# EAGLE schematic schema (EAGLE 7.5.0)
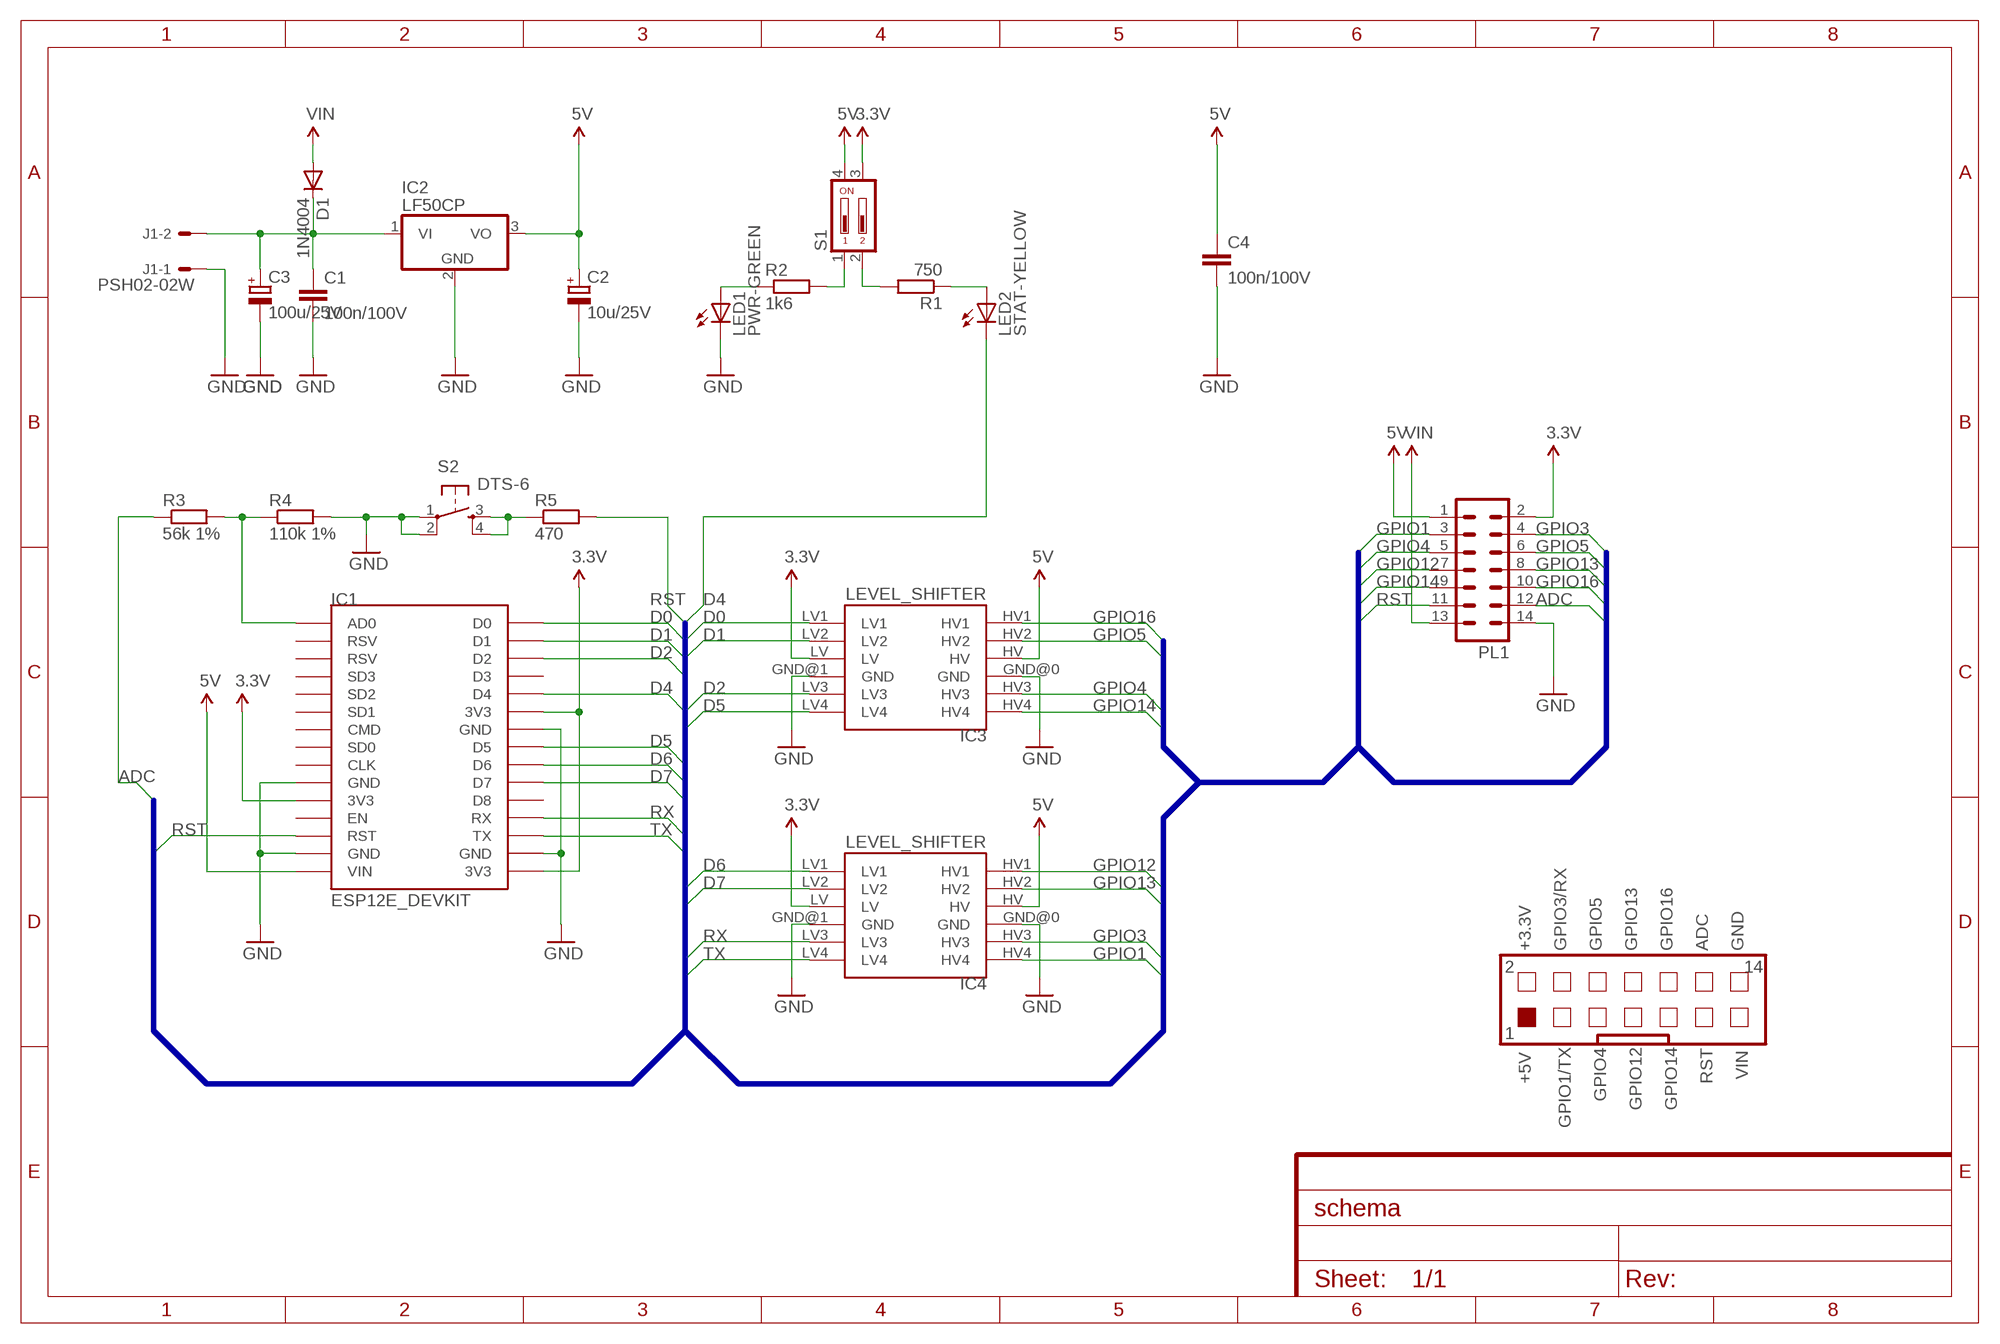
[diagram p0: schematic, sheet 1]
FRAME1 (FRAME-A4L): CNAME: IoT Lab Module; CREVISION: 1; DESIGNER: Vagovszky M.

## Parts
C1  100n/100V  C-EUC025-025X050  [C025-025X050]
C2  10u/25V  CPOL-EUE3,5-8  [E3,5-8]
C3  100u/25V  CPOL-EUE5-13  [E5-13]
C4  100n/100V  C-EUC025-025X050  [C025-025X050]
D1  1N4004  [DO41-10]
IC1  ESP12E_DEVKIT  [ESP12E_DEVKIT]
IC2  LF50CP  [TO220H]
IC3  LEVEL_SHIFTER  [LEVEL_SHIFTER]
IC4  LEVEL_SHIFTER  [LEVEL_SHIFTER]
J1  PSH02-02W  22-05-7028-02  [7395-02]
LED1  PWR-GREEN  LED3MM  [LED3MM]
LED2  STAT-YELLOW  LED3MM  [LED3MM]
PL1  14V  [14V]
R1  750  R-EU_R1206  [R1206]
R2  1k6  R-EU_R1206  [R1206]
R3  56k 1%  R-EU_R1206  [R1206]
R4  110k 1%  R-EU_R1206  [R1206]
R5  470  R-EU_R1206  [R1206]
S1  DIP02YL  [DIP02YL]
S2  DTS-6  [DTS-6]

## Nets
3.3V: IC1.3V3@0(3V3) IC1.3V3@1(3V3) IC1.3V3@2(3V3) IC3.LV IC4.LV PL1.2 S1.3
5V: C2.+ C4.1 IC1.VIN IC2.3(VO) IC3.HV IC4.HV PL1.1 S1.4
ADC: PL1.12 R3.1
D0: IC1.D0 IC3.LV1
D1: IC1.D1 IC3.LV2
D2: IC1.D2 IC3.LV3
D4: IC1.D4 LED2.K(C)
D5: IC1.D5 IC3.LV4
D6: IC1.D6 IC4.LV1
D7: IC1.D7 IC4.LV2
GND: C1.2 C2.- C3.- C4.2 IC1.GND@0(GND) IC1.GND@1(GND) IC1.GND@2(GND) IC1.GND@3(GND) IC2.2(GND) IC3.GND@0(GND) IC3.GND@1(GND) IC4.GND@0(GND) IC4.GND@1(GND) J1.1 LED1.K(C) PL1.14 R4.2 S2.1 S2.2
GPIO1: IC4.HV4 PL1.3
GPIO3: IC4.HV3 PL1.4
GPIO4: IC3.HV3 PL1.5
GPIO5: IC3.HV2 PL1.6
GPIO12: IC4.HV1 PL1.7
GPIO13: IC4.HV2 PL1.8
GPIO14: IC3.HV4 PL1.9
GPIO16: IC3.HV1 PL1.10
N$1: IC1.AD0 R3.2 R4.1
N$2: LED1.A R2.1
N$3: R2.2 S1.1
N$4: R5.1 S2.3 S2.4
N$5: R1.2 S1.2
N$6: LED2.A R1.1
N$14: C1.1 C3.+ D1.C IC2.1(VI) J1.2
RST: IC1.RST PL1.11 R5.2
RX: IC1.RX IC4.LV3
TX: IC1.TX IC4.LV4
VIN: D1.A PL1.13
Unconnected: IC1.CLK IC1.CMD IC1.D3 IC1.D8 IC1.EN IC1.RSV@0(RSV) IC1.RSV@1(RSV) IC1.SD0 IC1.SD1 IC1.SD2 IC1.SD3

## Buses
BUS:RST,ADC,D[0..2],D[4..7],RX,TX,GPIO16,GPIO[4..5],GPIO[12..14],GPIO1,GPIO3

## Notes on the sheet
- +3.3V | GPIO3/RX | GPIO5 | GPIO13 | GPIO16 | ADC | GND
- 2 | 14
- 1
- +5V | RST | VIN
- GPIO4
- GPIO12 | GPIO14
- GPIO1/TX

## Library data of the parts
C1 C4 = parts:C-EU: C-EU
C2 C3 = parts:CPOL-EU: C-POL EU
D1 = adafruit:1N4004: DIODE General purpose 1N400x type rectifier (With bigger pads) http://www.ladyada.net/library/pcb/eaglelibrary.html
IC1 = ESP12E_DEVKIT:ESP12E_DEVKIT: ESP12E DEVKIT BOARD
IC2 = parts:LF50: 5V LDO Regulator
IC3 IC4 = level_shifter:LEVEL_SHIFTER: Level shifter 5V <=> 3.3V
J1 = con-molex:22-?-02: CONNECTOR wire to board 2.54 mm (.1 inch) pitch header; OC_FARNELL: 9731601; OC_NEWARK: unknown
LED1 LED2 = adafruit:LED: LED OSRAM: - CHIPLED LG R971, LG N971, LY N971, LG Q971, LY Q971, LO R971, LY R971 LH N974, LH R974 LS Q976, LO Q976, LY Q976 LO Q996 - Hyper CHIPLED LW Q18S LB Q993, LB Q99A, LB R99A - SideLED LS A670, LO A670, LY A670, LG A670, LP A670 LB A673, LV A673, LT A673, LW A673 LH A674 LY A675 LS A676, LA A676, LO A676, LY A676, LW A676 LS A679, LY A679, LG A679 - Hyper Micro SIDELED® LS Y876, LA Y876, LO Y876, LY Y876 LT Y87S - SmartLED LW L88C, LW L88S LB L89C, LB L89S, LG L890 LS L89K, LO L89K, LY L89K LS L896, LA L896, LO L896, LY L896 - TOPLED LS T670, LO T670, LY T670, LG T670, LP T670 LSG T670, LSP T670, LSY T670, LOP T670, LYG T670 LG T671, LOG T671, LSG T671 LB T673, LV T673, LT T673, LW T673 LH T674 LS T676, LA T676, LO T676, LY T676, LB T676, LH T676, LSB T676, LW T676 LB T67C, LV T67C, LT T67C, LS T67K, LO T67K, LY T67K, LW E67C LS E67B, LA E67B, LO E67B, LY E67B, LB E67C, LV E67C, LT E67C LW T67C LS T679, LY T679, LG T679 LS T770, LO T770, LY T770, LG T770, LP T770 LB T773, LV T773, LT T773, LW T773 LH T774 LS E675, LA E675, LY E675, LS T675 LS T776, LA T776, LO T776, LY T776, LB T776 LHGB T686 LT T68C, LB T68C - Hyper Mini TOPLED® LB M676 - Mini TOPLED Santana® LG M470 LS M47K, LO M47K, LY M47K Source: http://www.osram.convergy.de/
PL1 = parts:14V: CONNECTOR; OC_FARNELL: unknown; OC_NEWARK: unknown
R1-R5 = rcl:R-EU_: RESISTOR, European symbol
S1 = switch-dil:DIP02YL: DIL/CODE SWITCH; OC_FARNELL: unknown; OC_NEWARK: unknown
S2 = switch-tact:DTS-6